# Altium schematic sheet LevelShifting.SchDoc
size A4; CompanyName: Technische Hochschule Nürnberg Georg Simon Ohm; Organization: UltraZohm; Address1: Kesslerplatz 12; Address2: 90489 Nürnberg; Address3: GERMANY; SheetNumber: 11; SheetTotal: 36; Website: www.ultrazohm.com
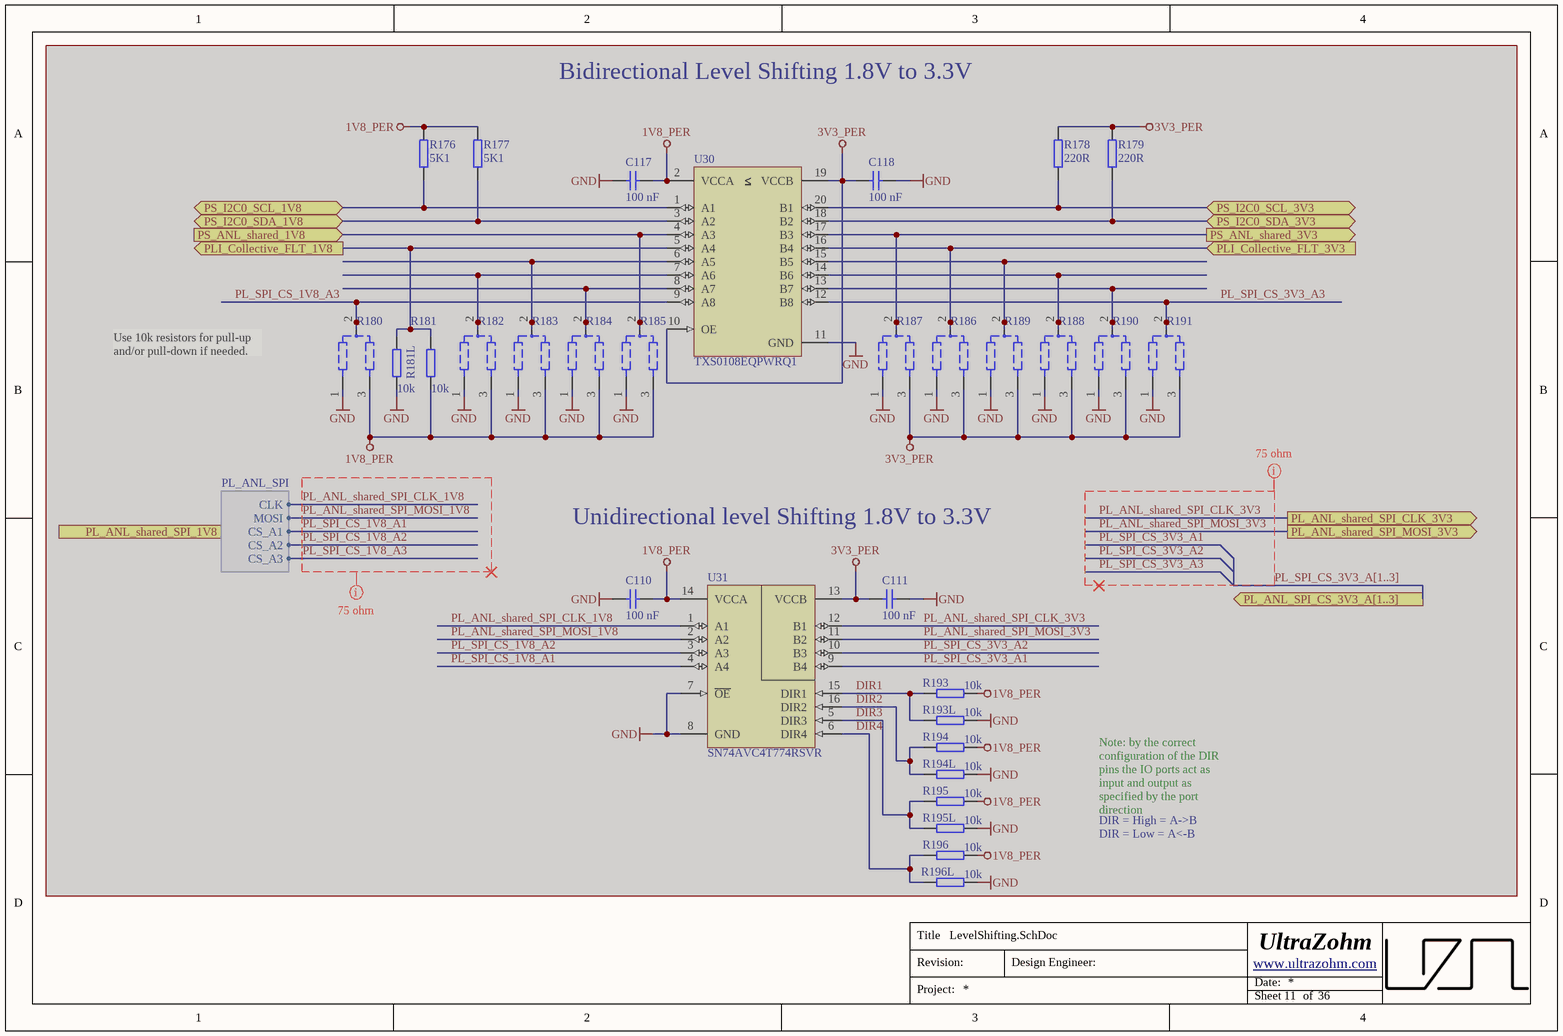
[diagram p0: LevelShifting.SchDoc]

## Parts
C110  100 nF  [C_0603_TE]  (masked out: inside a compile mask, not in the netlist)
C111  100 nF  [C_0603_TE]  (masked out: inside a compile mask, not in the netlist)
C117  100 nF  [C_0603_TE]  (masked out: inside a compile mask, not in the netlist)
C118  100 nF  [C_0603_TE]  (masked out: inside a compile mask, not in the netlist)
R176  5K1  [RESC1608X55N_V]  (masked out: inside a compile mask, not in the netlist)
R177  5K1  [RESC1608X55N_V]  (masked out: inside a compile mask, not in the netlist)
R178  220R  [RESC1608X55N_V]  (masked out: inside a compile mask, not in the netlist)
R179  220R  [RESC1608X55N_V]  (masked out: inside a compile mask, not in the netlist)
R180  Manual Assembly 1608 (0603)  [TP_DUAL_RES_0603]  (value not drawn)  (no BOM)  (masked out: inside a compile mask, not in the netlist)
R181  10k  [R_0603_TE]  (masked out: inside a compile mask, not in the netlist)
R181L  10k  [R_0603_TE]  (masked out: inside a compile mask, not in the netlist)
R182  Manual Assembly 1608 (0603)  [TP_DUAL_RES_0603]  (value not drawn)  (no BOM)  (masked out: inside a compile mask, not in the netlist)
R183  Manual Assembly 1608 (0603)  [TP_DUAL_RES_0603]  (value not drawn)  (no BOM)  (masked out: inside a compile mask, not in the netlist)
R184  Manual Assembly 1608 (0603)  [TP_DUAL_RES_0603]  (value not drawn)  (no BOM)  (masked out: inside a compile mask, not in the netlist)
R185  Manual Assembly 1608 (0603)  [TP_DUAL_RES_0603]  (value not drawn)  (no BOM)  (masked out: inside a compile mask, not in the netlist)
R186  Manual Assembly 1608 (0603)  [TP_DUAL_RES_0603]  (value not drawn)  (no BOM)  (masked out: inside a compile mask, not in the netlist)
R187  Manual Assembly 1608 (0603)  [TP_DUAL_RES_0603]  (value not drawn)  (no BOM)  (masked out: inside a compile mask, not in the netlist)
R188  Manual Assembly 1608 (0603)  [TP_DUAL_RES_0603]  (value not drawn)  (no BOM)  (masked out: inside a compile mask, not in the netlist)
R189  Manual Assembly 1608 (0603)  [TP_DUAL_RES_0603]  (value not drawn)  (no BOM)  (masked out: inside a compile mask, not in the netlist)
R190  Manual Assembly 1608 (0603)  [TP_DUAL_RES_0603]  (value not drawn)  (no BOM)  (masked out: inside a compile mask, not in the netlist)
R191  Manual Assembly 1608 (0603)  [TP_DUAL_RES_0603]  (value not drawn)  (no BOM)  (masked out: inside a compile mask, not in the netlist)
R193  10k  [R_0603_TE]  (masked out: inside a compile mask, not in the netlist)
R193L  10k  [R_0603_TE]  (masked out: inside a compile mask, not in the netlist)
R194  10k  [R_0603_TE]  (masked out: inside a compile mask, not in the netlist)
R194L  10k  [R_0603_TE]  (masked out: inside a compile mask, not in the netlist)
R195  10k  [R_0603_TE]  (masked out: inside a compile mask, not in the netlist)
R195L  10k  [R_0603_TE]  (masked out: inside a compile mask, not in the netlist)
R196  10k  [R_0603_TE]  (masked out: inside a compile mask, not in the netlist)
R196L  10k  [R_0603_TE]  (masked out: inside a compile mask, not in the netlist)
U30  TXS0108EQPWRQ1  [SOP65P640X120-20N]  (masked out: inside a compile mask, not in the netlist)
U31  SN74AVC4T774RSVR  [QFN40P260X180X55-16N]  (masked out: inside a compile mask, not in the netlist)

## Ports
PL_ANL_shared_SPI_1V8 (harness PL_ANL_SPI), PL_ANL_shared_SPI_CLK_3V3 (out), PL_ANL_shared_SPI_MOSI_3V3 (out), PL_ANL_SPI_CS_3V3_A[1..3] (out), PLI_Collective_FLT_1V8 (out), PLI_Collective_FLT_3V3 (in), PS_ANL_shared_1V8 (in), PS_ANL_shared_3V3 (out), PS_I2C0_SCL_1V8 (bidir), PS_I2C0_SCL_3V3 (bidir), PS_I2C0_SDA_1V8 (bidir), PS_I2C0_SDA_3V3 (bidir)

## Harnesses
PL_ANL_SPI: CLK, CS_A1, CS_A2, CS_A3, MOSI

## Layout directives
net class S75: PL_ANL_shared_SPI_CLK_1V8, PL_ANL_shared_SPI_CLK_3V3, PL_ANL_shared_SPI_MOSI_1V8, PL_ANL_shared_SPI_MOSI_3V3, PL_SPI_CS_1V8_A1, PL_SPI_CS_1V8_A2, PL_SPI_CS_1V8_A3, PL_SPI_CS_3V3_A1, PL_SPI_CS_3V3_A2, PL_SPI_CS_3V3_A3, PL_SPI_CS_3V3_A[1..3]

## Notes on the sheet
- Bidirectional Level Shifting 1.8V to 3.3V
- Use 10k resistors for pull-up and/or pull-down if needed.
- Unidirectional level Shifting 1.8V to 3.3V
- DIR = High = A->B
- DIR = Low = A<-B
- Note: by the correct configuration of the DIR pins the IO ports act as input and output as specified by the port direction
- Title
- Revision:
- Design Engineer:
- Date:
- Project:
- Sheet
- of

## Library data of the parts
C110 C111 C117 C118 = UZgen_C_0603_100nF_50V_X7R: Generic capacitor; Manufacturer: UZgen; Tolerance: 10 %; Voltage: 50 V; Created from: AGeiger; Value: 100 nF; Technology: X7R; Manufacturer Part Number: UZgen_C_0603_100nF_50V_X7R; PartID: 1; Created On: 02/07/2024 14:42:23; Device Package: 0603; Mounting Type: SMD; Last Updated: 02/08/2024 14:45:57
R176 R177 = 21379: WID SMD 5K1 1% 0,1W; AN: 21379; Mixed: SMT; Value: 5.1K; Preferred: Yes; Extra: BF 1608 (0603); Tolerance: 1%; Case: 1608 (0603); Technology: TK100
R178 R179 = 22324: WID SMD 220R 1% 0,1W; Value: 220; AN: 22324; Mixed: SMT; Extra: BF 1608 (0603); Tolerance: 1%; Case: 1608 (0603); Technology: TK100
R180 R182-R191 = 30792: Manual Assembly Resistors Placeholder 1608 (0603) Dual; AN: 30792; Mixed: MECH
R181 R181L R193 R193L R194 R194L R195 R195L R196 R196L = UZgen_R_0603_10k: Generic resistor; Manufacturer: UZgen; Tolerance: 1 %; Created from: AGeiger; Value: 10k; Manufacturer Part Number: UZgen_R_0603_10k; PartID: 1; Created On: 02.07.2024 14:34:53; Device Package: 0603; Mounting Type: SMD; Last Updated: 02.07.2024 14:37:16
U30 = 30791: AN: 30791; Mixed: SMT; Temperature-Range: -40/+85; Extra: 8-Bit Bidirectional Voltage Translator for OD/Push-Pull; HelpURL: b:\AD\adlib\datasheet\TI\TXS0108E-Q1\; H-ART: TXS0108EQPWRQ1; Storage-Temperature: -65/+150(Abs); Case: TSSOP20
U31 = 27170: AN: 27170; Mixed: SMT; Trenz-Stock: Yes; Extra: 4-Bit Dual-Supply Bus Transceiver With Configurable Voltage Translationand 3-Sta; HelpURL: B:\ad\adlib\datasheet\sn74avc4t774; Case: UQFN-16; H-ART: SN74AVC4T774RSVR